# Altium schematic sheet 2.4ghz Receiver Board.SchDoc: 2.4Ghz Receiver Board
size Letter
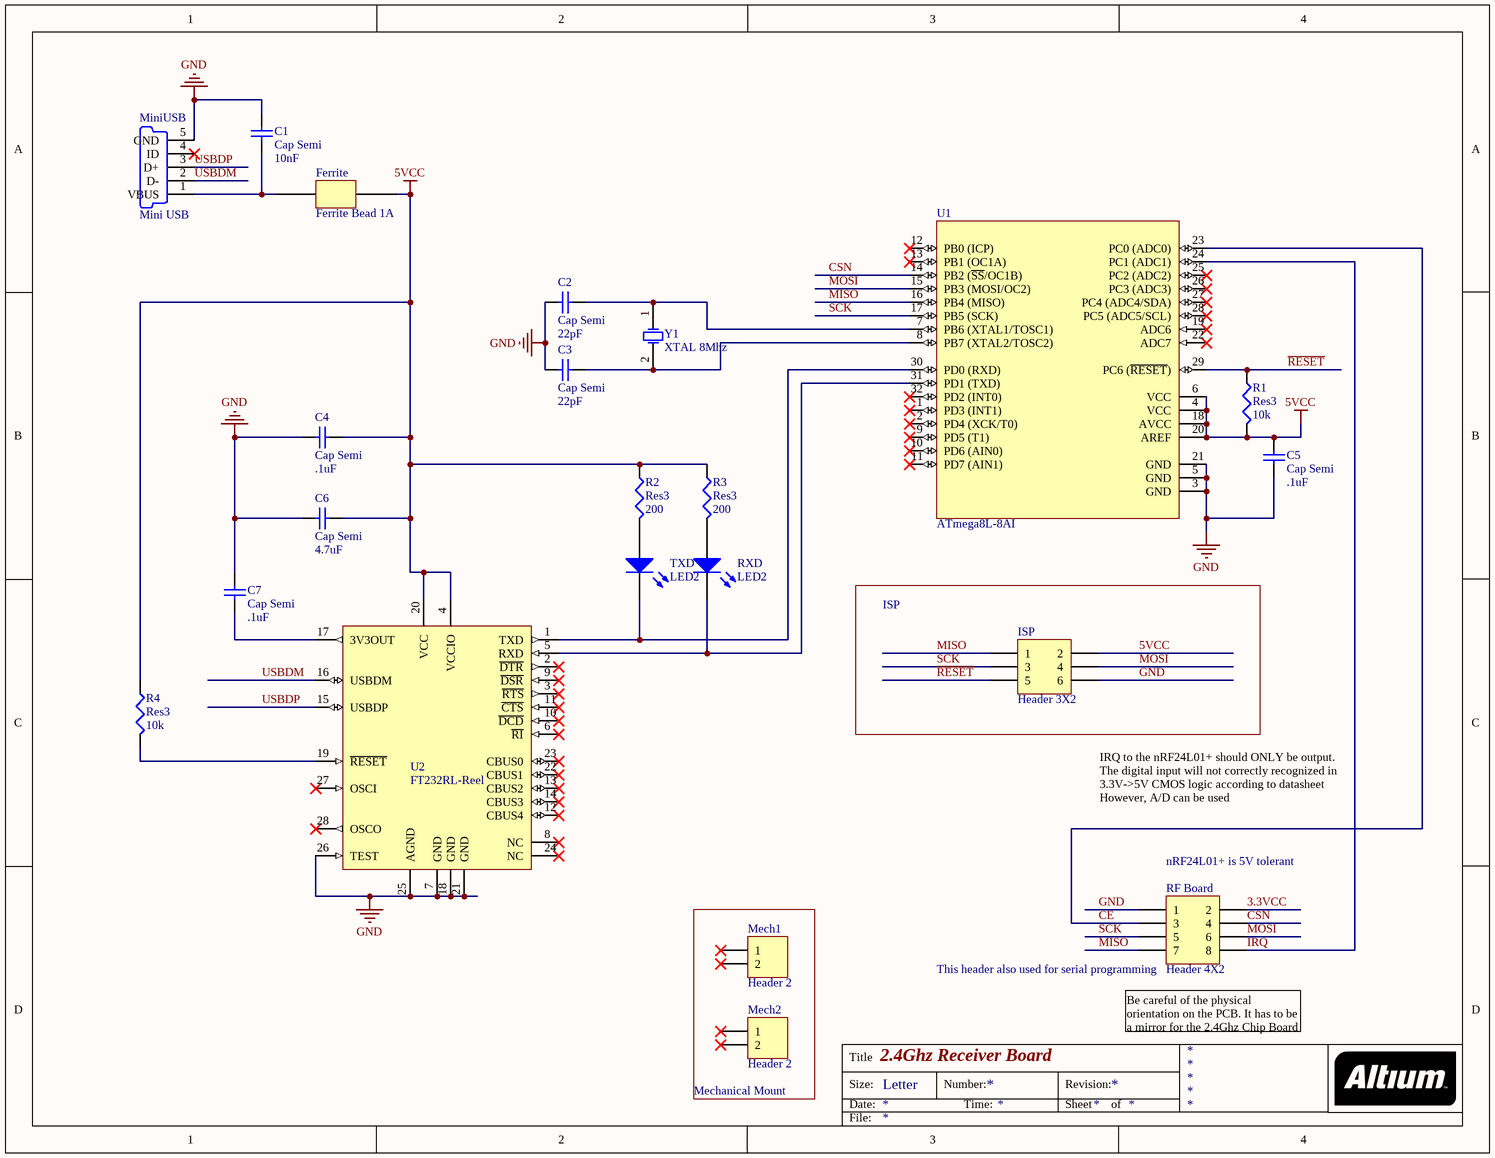
[diagram p0: 2.4ghz Receiver Board.SchDoc]

## Parts
C1  Cap Semi  value 10nF  [CAPC2012L]
C2  Cap Semi  value 22pF  [CAPC2012L]
C3  Cap Semi  value 22pF  [CAPC2012L]
C4  Cap Semi  value .1uF  [CAPC2012L]
C5  Cap Semi  value .1uF  [CAPC2012L]
C6  Cap Semi  value 4.7uF  [CAPC2012L]
C7  Cap Semi  value .1uF  [CAPC2012L]
Ferrite  Ferrite Bead 1A  [RESC2012N]
ISP  Header 3X2  [HDR2X3]
Mech1  Header 2  [HDR1X2]
Mech2  Header 2  [HDR1X2]
MiniUSB  Mini USB  [MINI USB]
R1  Res3  value 10k  [RESC2012N]
R2  Res3  value 200  [RESC2012N]
R3  Res3  value 200  [RESC2012N]
R4  Res3  value 10k  [RESC2012N]
RF_Board  Header 4X2  [HDR2X4]
RXD  LED2  [RESC3216N]
TXD  LED2  [RESC1608N]
U1  ATmega8L-8AI  [32A_N]
U2  FT232RL-Reel  [SSOP-28_N]
Y1  XTAL 8Mhz  [HC-49U - SMD]

## Blocks framed on the sheet
ISP: ISP
Mechanical Mount: Mech1 Mech2

## Nets
5VCC: C4.2 C5.2 C6.2 Ferrite.2 ISP.2 R1.2 R2.1 R3.1 R4.1 U1.4(VCC) U1.6(VCC) U1.18(AVCC) U1.20(AREF) U2.4(VCCIO) U2.20(VCC)
GND: C1.2 C2.1 C3.1 C4.1 C5.1 C6.1 C7.2 ISP.6 MiniUSB.5(GND) RF_Board.1 U1.3(GND) U1.5(GND) U1.21(GND) U2.7(GND) U2.18(GND) U2.21(GND) U2.25(AGND) U2.26(TEST)
3.3VCC: RF_Board.2
~{RESET}: ISP.5 R1.1 U1.29(PC6_(~{RESET}))
CE: RF_Board.3 U1.23(PC0_(ADC0))
CSN: RF_Board.4 U1.14(PB2_(~{SS}/OC1B))
IRQ: RF_Board.8 U1.24(PC1_(ADC1))
MISO: ISP.1 RF_Board.7 U1.16(PB4_(MISO))
MOSI: ISP.4 RF_Board.6 U1.15(PB3_(MOSI/OC2))
SCK: ISP.3 RF_Board.5 U1.17(PB5_(SCK))
USBDM: MiniUSB.2(D-) U2.16(USBDM)
USBDP: MiniUSB.3(D+) U2.15(USBDP)
NetC1_1: C1.1 Ferrite.1 MiniUSB.1(VBUS)
NetC2_2: C2.2 U1.7(PB6_(XTAL1/TOSC1)) Y1.1(OSC1)
NetC3_2: C3.2 U1.8(PB7_(XTAL2/TOSC2)) Y1.2(OSC2)
NetC7_1: C7.1 U2.17(3V3OUT)
NetR2_2: R2.2 TXD.1(A)
NetR3_2: R3.2 RXD.1(A)
NetR4_2: R4.2 U2.19(~{RESET})
NetRXD_2: RXD.2(K) U1.31(PD1_(TXD)) U2.5(RXD)
NetTXD_2: TXD.2(K) U1.30(PD0_(RXD)) U2.1(TXD)

Not connected (* = marked no-connect by the designer): Mech1 1* 2*; Mech2 1* 2*; MiniUSB 4(ID)*; U1 1(PD3_(INT1))* 2(PD4_(XCK/T0))* 9(PD5_(T1))* 10(PD6_(AIN0))* 11(PD7_(AIN1))* 12(PB0_(ICP))* 13(PB1_(OC1A))* 19(ADC6)* 22(ADC7)* 25(PC2_(ADC2))* 26(PC3_(ADC3))* 27(PC4_(ADC4/SDA))* 28(PC5_(ADC5/SCL))* 32(PD2_(INT0))*; U2 2(~{DTR})* 3(~{RTS})* 6(~{RI})* 8(NC)* 9(~{DSR})* 10(~{DCD})* 11(~{CTS})* 12(CBUS4)* 13(CBUS2)* 14(CBUS3)* 22(CBUS1)* 23(CBUS0)* 24(NC)* 27(OSCI)* 28(OSCO)*

## Notes on the sheet
- IRQ to the nRF24L01+ should ONLY be output. The digital input will not correctly recognized in 3.3V->5V CMOS logic according to datasheet
  However, A/D can be used
- (near RF_Board) nRF24L01+ is 5V tolerant
- (near RF_Board) This header also used for serial programming
- (near RF_Board) Be careful of the physical orientation on the PCB. It has to be a mirror for the 2.4Ghz Chip Board
- Title
- Size:
- Date:
- Letter
- Number:
- Time:
- Revision:
- Sheet
- of
- File:

## Library data of the parts
C1-C7 = Cap Semi: Capacitor (Semiconductor SIM Model); Published: 8-Jun-2000; LatestRevisionDate: 29-May-2009; LatestRevisionNote: IPC-7351 Footprint Added.; PackageReference: C1206; Publisher: Altium Limited; PackageDescription: Chip Capacitor
Ferrite = Ferrite Bead
ISP = Header 3X2: Header, 3-Pin, Dual row; LatestRevisionDate: 17-Jul-2002; LatestRevisionNote: Re-released for DXP Platform.; Publisher: Altium Limited
Mech1 Mech2 = Header 2: Header, 2-Pin; LatestRevisionDate: 17-Jul-2002; LatestRevisionNote: Re-released for DXP Platform.; Publisher: Altium Limited
R1-R4 = Res3: Resistor; Published: 8-Jun-2000; LatestRevisionDate: 29-May-2009; LatestRevisionNote: IPC-7351 Footprint Added.; PackageReference: J1-0603; Publisher: Altium Limited; PackageDescription: Chip Resistor
RF_Board = Header 4X2: Header, 4-Pin, Dual row; LatestRevisionDate: 17-Jul-2002; LatestRevisionNote: Re-released for DXP Platform.; Publisher: Altium Limited
RXD TXD = LED2: Typical RED, GREEN, YELLOW, AMBER GaAs LED; Published: 8-Jun-2000; LatestRevisionDate: 17-Jul-2002; LatestRevisionNote: Re-released for DXP Platform.; PackageVersion: Feb-2002; PackageReference: 3.2X1.6X1.1; Publisher: Altium Limited; PackageDescription: SM LED; 2 Flat Leads
U1 = ATmega8L-8AI: 8-Bit AVR Microcontroller with 8K Bytes of In-System Programmable Flash Memory; Published: 17-Sep-2003; LatestRevisionDate: 13-Apr-2006; LatestRevisionNote: IPC-7351 Footprint Added.; DatasheetVersion: 2486H-AVR-09/02; PackageVersion: revB, Oct-2001; PackageReference: 32A; Publisher: Altium Limited; PackageDescription: 32-Pin Thin Quad Flat Pack 0.8 mm Pitch; Code_JEDEC: MS-026-ABA; ComponentLink1Description: Manufacturer Link; ComponentLink1URL: http://www.atmel.com; ComponentLink2Description: Datasheet; ComponentLink2URL: http://www.atmel.com/dyn/resources/prod_documents/doc2486.pdf
U2 = FT232RL-Reel: USB UART Asynchronous Serial Data Transfer Chip, SSOP-28, Tape and Reel; Published: 19-Aug-2010; DatasheetVersion: ver 2.07, Jul-2010; PackageVersion: 2010; PackageReference: SSOP-28; Publisher: Altium Limited; PackageDescription: 28-Pin Small Outline Package 0.65 mm Pitch; ComponentLink1Description: Manufacturer Link; ComponentLink1URL: http://www.ftdichip.com/Products/ICs/FT232R.htm; ComponentLink2Description: Datasheet; ComponentLink2URL: http://www.ftdichip.com/Support/Documents/DataSheets/ICs/DS_FT232R.pdf
Y1 = XTAL: Crystal Oscillator; Published: 8-Jun-2000; LatestRevisionDate: 17-Jul-2002; LatestRevisionNote: Re-released for DXP Platform.; PackageReference: R38; Publisher: Altium Limited; PackageDescription: Crystal, Thru-Hole; 2 Leads; Body 3.1 x 8.2 mm (Dia.xH)
MiniUSB = Mini USB: Supplier 1: Digi-Key; Supplier Part Number 1: A31727CT-ND